# Altium project Quadcopter_Main_PCB.PrjPcb
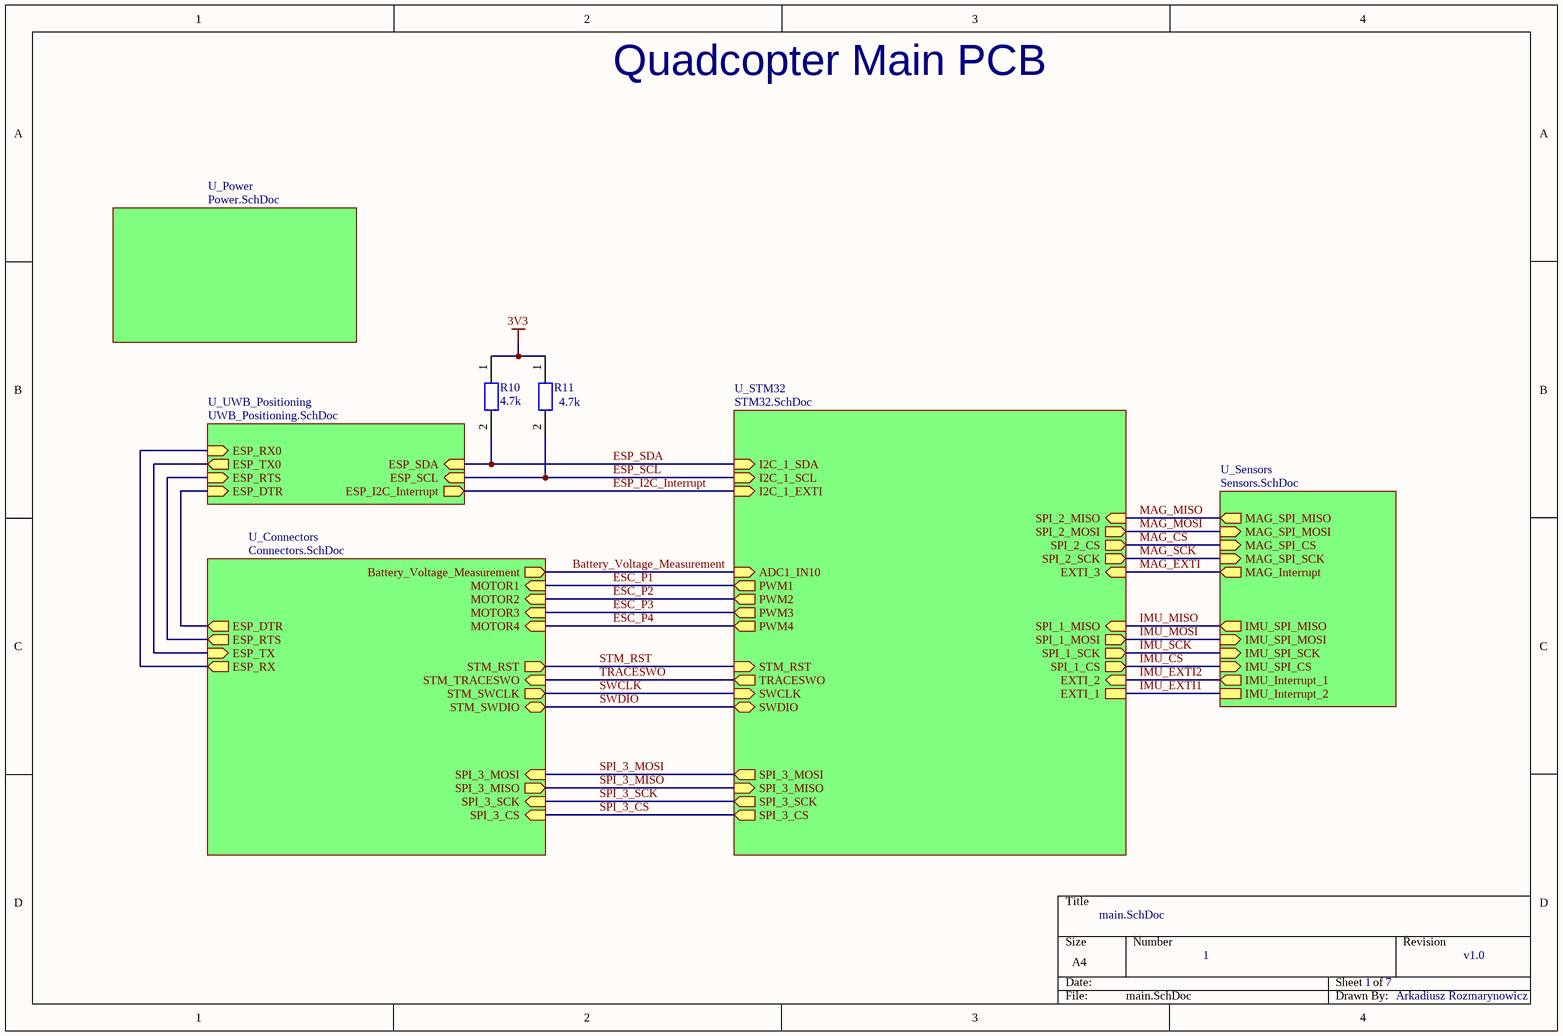
[diagram p0: main.SchDoc]
Author_Name: Arkadiusz Rozmarynowicz; Project_Revision: v1.0
7 sheets, 101 parts. Net scope: hierarchical (ports join the sheet entries above them; power ports are global).
Board file: Quadcopter_Main_PCB.PcbDoc
Sheets:
  main.SchDoc
    U_Power = Power.SchDoc
    U_Connectors = Connectors.SchDoc
    U_UWB_Positioning = UWB_Positioning.SchDoc
    U_Sensors = Sensors.SchDoc
    U_STM32 = STM32.SchDoc
      U_Interface_STM32 = Interface_STM32.SchDoc

## Sheet main.SchDoc
size A4; Author: Arkadiusz Rozmarynowicz; DrawnBy: Arkadiusz Rozmarynowicz; DocumentNumber: 1; SheetNumber: 1; SheetTotal: 7

### Parts
R10  4.7k  [Res_0603_Medium_Density]
R11  4.7k  [Res_0603_Medium_Density]

### Sub-sheets
U_Connectors = Connectors.SchDoc: ESP_RTS (out), ESP_DTR (out), ESP_RX (out), STM_SWCLK (out), STM_RST (out), ESP_TX (in), STM_SWDIO (bidir), MOTOR1 (in), MOTOR2 (in), MOTOR3 (in), MOTOR4 (in), STM_TRACESWO (in), Battery_Voltage_Measurement (out), SPI_3_CS (in), SPI_3_SCK (in), SPI_3_MISO (out), SPI_3_MOSI (in)
U_Power = Power.SchDoc: no entries
U_Sensors = Sensors.SchDoc: MAG_SPI_MISO (out), MAG_SPI_MOSI (in), MAG_SPI_CS (in), MAG_SPI_SCK (in), MAG_Interrupt (out), IMU_SPI_MISO (out), IMU_SPI_MOSI (in), IMU_SPI_SCK (in), IMU_SPI_CS (in), IMU_Interrupt_1 (out), IMU_Interrupt_2
U_STM32 = STM32.SchDoc: SPI_1_CS (out), SPI_1_SCK (out), SPI_1_MISO (in), SPI_1_MOSI (out), PWM1 (out), PWM2 (out), PWM3 (out), PWM4 (out), SWDIO (bidir), SWCLK (in), SPI_3_CS (out), SPI_2_MISO (in), SPI_2_MOSI (out), SPI_3_SCK (out), SPI_3_MISO (in), SPI_3_MOSI (out), SPI_2_CS (out), SPI_2_SCK (out), TRACESWO (out), ADC1_IN10 (in), EXTI_2 (in), EXTI_3 (in), I2C_1_SCL (in), I2C_1_SDA (in), STM_RST (in), EXTI_1, I2C_1_EXTI (in)
U_UWB_Positioning = UWB_Positioning.SchDoc: ESP_DTR (in), ESP_RX0 (in), ESP_TX0 (out), ESP_RTS (in), ESP_I2C_Interrupt (out), ESP_SDA (in), ESP_SCL (in)

### Nets
3V3: R10.1 R11.1
Battery_Voltage_Measurement: sheet U_Connectors/Battery_Voltage_Measurement, sheet U_STM32/ADC1_IN10
ESC_P1: sheet U_Connectors/MOTOR1, sheet U_STM32/PWM1
ESC_P2: sheet U_Connectors/MOTOR2, sheet U_STM32/PWM2
ESC_P3: sheet U_Connectors/MOTOR3, sheet U_STM32/PWM3
ESC_P4: sheet U_Connectors/MOTOR4, sheet U_STM32/PWM4
ESP_DTR: sheet U_Connectors/ESP_DTR, sheet U_UWB_Positioning/ESP_DTR
ESP_I2C_Interrupt: sheet U_UWB_Positioning/ESP_I2C_Interrupt, sheet U_STM32/I2C_1_EXTI
ESP_RTS: sheet U_Connectors/ESP_RTS, sheet U_UWB_Positioning/ESP_RTS
ESP_RXD0: sheet U_Connectors/ESP_RX, sheet U_UWB_Positioning/ESP_RX0
ESP_SCL: R11.2 ; sheet U_UWB_Positioning/ESP_SCL, sheet U_STM32/I2C_1_SCL
ESP_SDA: R10.2 ; sheet U_UWB_Positioning/ESP_SDA, sheet U_STM32/I2C_1_SDA
ESP_TXD0: sheet U_Connectors/ESP_TX, sheet U_UWB_Positioning/ESP_TX0
IMU_CS: sheet U_Sensors/IMU_SPI_CS, sheet U_STM32/SPI_1_CS
IMU_EXTI1: sheet U_Sensors/IMU_Interrupt_2, sheet U_STM32/EXTI_1
IMU_EXTI2: sheet U_Sensors/IMU_Interrupt_1, sheet U_STM32/EXTI_2
IMU_MISO: sheet U_Sensors/IMU_SPI_MISO, sheet U_STM32/SPI_1_MISO
IMU_MOSI: sheet U_Sensors/IMU_SPI_MOSI, sheet U_STM32/SPI_1_MOSI
IMU_SCK: sheet U_Sensors/IMU_SPI_SCK, sheet U_STM32/SPI_1_SCK
MAG_CS: sheet U_Sensors/MAG_SPI_CS, sheet U_STM32/SPI_2_CS
MAG_EXTI: sheet U_Sensors/MAG_Interrupt, sheet U_STM32/EXTI_3
MAG_MISO: sheet U_Sensors/MAG_SPI_MISO, sheet U_STM32/SPI_2_MISO
MAG_MOSI: sheet U_Sensors/MAG_SPI_MOSI, sheet U_STM32/SPI_2_MOSI
MAG_SCK: sheet U_Sensors/MAG_SPI_SCK, sheet U_STM32/SPI_2_SCK
SPI_3_CS: sheet U_Connectors/SPI_3_CS, sheet U_STM32/SPI_3_CS
SPI_3_MISO: sheet U_Connectors/SPI_3_MISO, sheet U_STM32/SPI_3_MISO
SPI_3_MOSI: sheet U_Connectors/SPI_3_MOSI, sheet U_STM32/SPI_3_MOSI
SPI_3_SCK: sheet U_Connectors/SPI_3_SCK, sheet U_STM32/SPI_3_SCK
STM_RST: sheet U_Connectors/STM_RST, sheet U_STM32/STM_RST
SWCLK: sheet U_Connectors/STM_SWCLK, sheet U_STM32/SWCLK
SWDIO: sheet U_Connectors/STM_SWDIO, sheet U_STM32/SWDIO
TRACESWO: sheet U_Connectors/STM_TRACESWO, sheet U_STM32/TRACESWO

### Notes on the sheet
- Quadcopter Main PCB

### Library data of the parts
R10 R11 = Resistor_SMD: Part Number: AC0603JR-104K7L; Value: 4.7k; Manufacturer: *; Supplier: Mouser; Voltage: *; ComponentLink1Description: Online Store Link; ComponentLink1URL: *; Package: 0603

## Sheet Power.SchDoc
size A4; DocumentNumber: 2; SheetNumber: 2; SheetTotal: 7
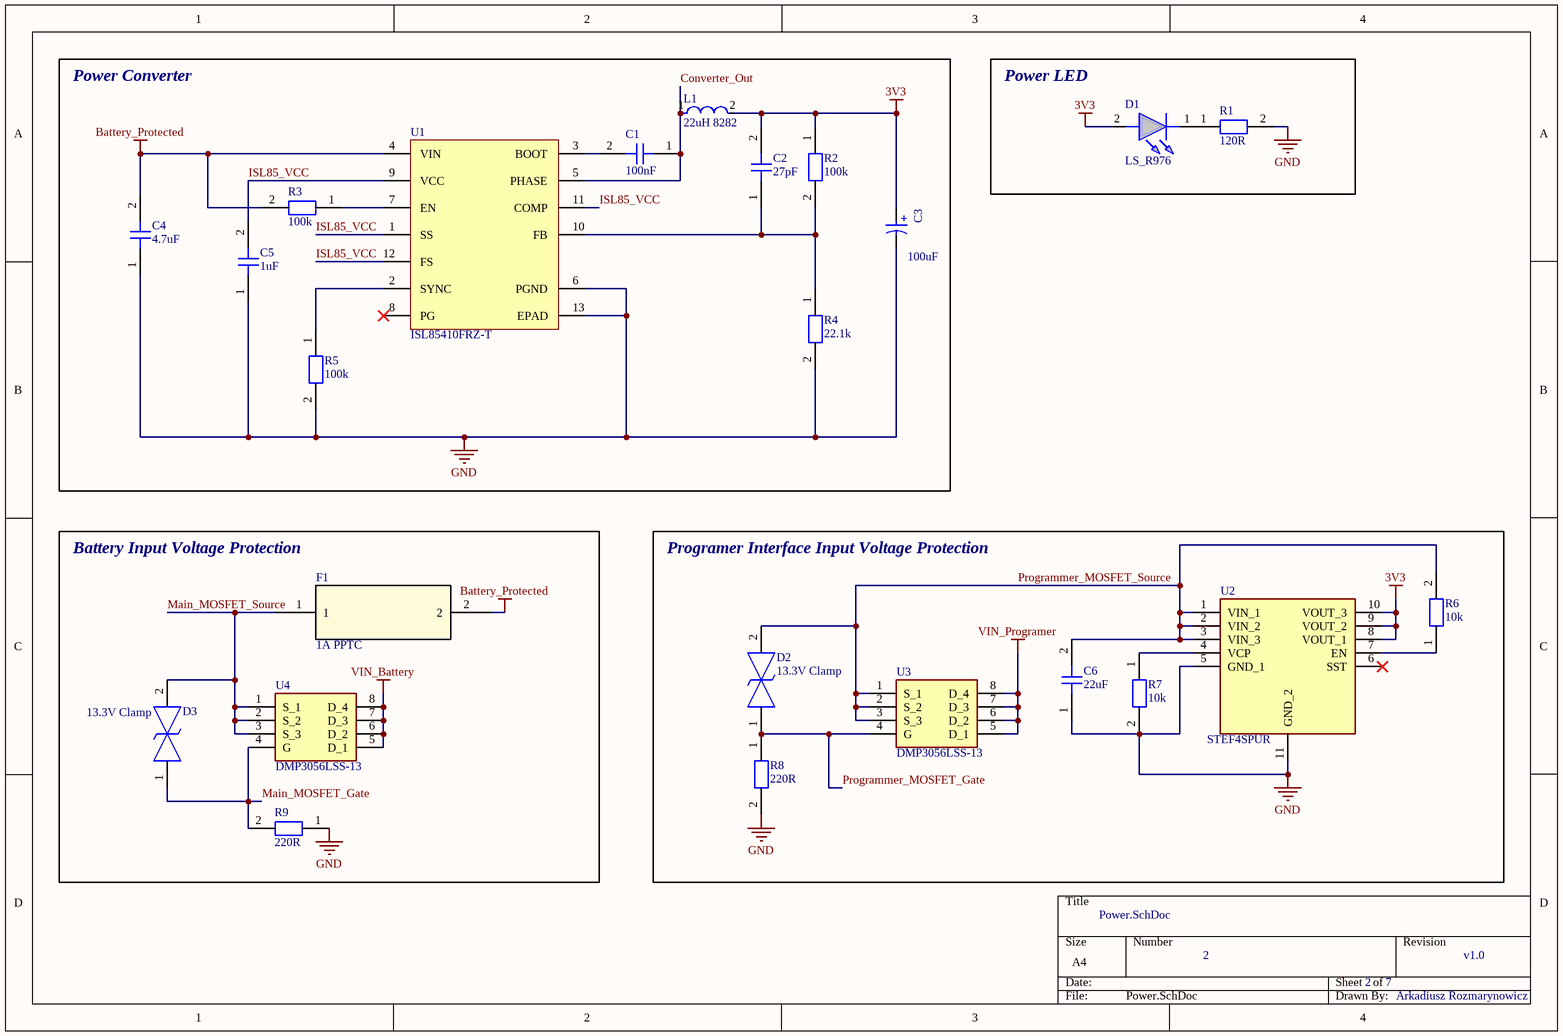
[diagram p1: Power.SchDoc]

### Parts
C1  100nF  [Cap_0603_Medium_Density]
C2  27pF  [Cap_0603_Medium_Density]
C3  100uF  [WCAP-ASLL_D6.3H5.5]
C4  4.7uF  [Cap_0603_Medium_Density]
C5  1uF  [Cap_0603_Medium_Density]
C6  22uF  [Cap_0603_Medium_Density]
D1  LS_R976  [LEDC2012X40N]
D2  13.3V Clamp  [DIONM5127X250N]
D3  13.3V Clamp  [DIONM5127X250N]
F1  1A PPTC  [CHIP_ 0603L_1P8X1_LTF]
L1  22uH 8282  [FP-IHLP-3232DZ-FP_2_413x5-MFG]
R1  120R  [Res_0603_Medium_Density]
R2  100k  [Res_0603_Medium_Density]
R3  100k  [Res_0603_Medium_Density]
R4  22.1k  [Res_0603_Medium_Density]
R5  100k  [Res_0603_Medium_Density]
R6  10k  [Res_0603_Medium_Density]
R7  10k  [Res_0603_Medium_Density]
R8  220R  [Res_0603_Medium_Density]
R9  220R  [Res_0603_Medium_Density]
U1  ISL85410FRZ-T  [L12_4x3_MFG]
U2  STEF4SPUR  [SON50P300X300X80-11N-D]
U3  DMP3056LSS-13  [SOIC127P600X170-8N]
U4  DMP3056LSS-13  [SOIC127P600X170-8N]

### Blocks framed on the sheet
Power Converter: C1-C5 L1 R2-R5 U1
Power LED: D1 R1
Battery Input Voltage Protection: D3 F1 R9 U4
Programer Interface Input Voltage Protection: C6 D2 R6-R8 U2 U3

### Nets
3V3: C2.2 C3.1(P) D1.2(A) L1.2 R2.1 U2.8(VOUT_1) U2.9(VOUT_2) U2.10(VOUT_3)
Battery_Protected: C4.2 F1.2 R3.2 U1.4(VIN)
GND: C3.2(N) C4.1 C5.1 C6.1 R1.2 R4.2 R5.2 R7.2 R8.2 R9.1 U1.6(PGND) U1.13(EPAD) U2.5(GND_1) U2.11(GND_2)
VIN_Battery: U4.5(D_1) U4.6(D_2) U4.7(D_3) U4.8(D_4)
VIN_Programer: U3.5(D_1) U3.6(D_2) U3.7(D_3) U3.8(D_4)
Converter_Out: C1.1 L1.1 U1.5(PHASE)
ISL85_VCC: C5.2 U1.1(SS) U1.9(VCC) U1.11(COMP) U1.12(FS)
Main_MOSFET_Gate: D3.1 R9.2 U4.4(G)
Main_MOSFET_Source: D3.2 F1.1 U4.1(S_1) U4.2(S_2) U4.3(S_3)
Programmer_MOSFET_Gate: D2.1 R8.1 U3.4(G)
Programmer_MOSFET_Source: C6.2 D2.2 R6.2 U2.1(VIN_1) U2.2(VIN_2) U2.3(VIN_3) U3.1(S_1) U3.2(S_2) U3.3(S_3)
NetC1_2: C1.2 U1.3(BOOT)
NetC2_1: C2.1 R2.2 R4.1 U1.10(FB)
NetD1_1: D1.1(K) R1.1
NetR3_1: R3.1 U1.7(EN)
NetR5_1: R5.1 U1.2(SYNC)
NetR6_1: R6.1 U2.7(EN)
NetR7_1: R7.1 U2.4(VCP)

Not connected (* = marked no-connect by the designer): U1 8(PG)*; U2 6(SST)*

### Notes on the sheet
- (in symbol CMP-03913-53914511-3) +

### Library data of the parts
C1 = Capacitor_MLLC: Part Number: CC0603KRX7R8BB104; Supplier: Mouser; ComponentLink1Description: Online Store Link; ComponentLink1URL: *; Manufacturer: *; Value: 100nF; Voltage: *; Package: 0603
C2 = Capacitor_MLLC: Part Number: CC0603JRNP09BN270; Supplier: Mouser; ComponentLink1Description: Online Store Link; ComponentLink1URL: *; Manufacturer: *; Value: 27pF; Voltage: *; Package: 0603
C3 = CMP-03913-53914511-3: WCAP-ASLL Aluminum Electrolytic Capacitors; Part Number: 865060343005; Life (Hours): 2000hours; Voltage Rating (DC): 16V; Ripple Current (AC): 255mA; Impedance: 440mΩ; ESR (Equivalent Series Resistance): 393.664mΩ; Insulation Resistance: 1MΩ; Leakage Current: 16µA; Capacitance: 100µF; Voltage Rating: 16V; Min Operating Temperature: -55°C; Ripple Current: 255mA; REACH SVHC: Unknown; Case/Package: Radial; Diameter: 6.3mm; Max Operating Temperature: 105°C; Packaging: Cut Tape; Length: 5.5mm; Height: 5.5mm; Supplier: Mouser; Value: 100uF
C4 = Capacitor_MLLC: Part Number: 06035U4R7JAT2A; Supplier: Mouser; ComponentLink1Description: Online Store Link; ComponentLink1URL: *; Manufacturer: *; Value: 4.7uF; Voltage: *; Package: 0603
C5 = Capacitor_MLLC: Part Number: CC0603KRX5R6BB105; Supplier: Mouser; ComponentLink1Description: Online Store Link; ComponentLink1URL: *; Manufacturer: *; Value: 1uF; Voltage: *; Package: 0603
C6 = Capacitor_MLLC: Part Number: CC0603MRX6S4BB226; Supplier: Mouser; ComponentLink1Description: Online Store Link; ComponentLink1URL: *; Manufacturer: *; Value: 22uF; Voltage: *; Package: 0603
D1 = LS_R976: Red 0805 CHIPLED LS R976N-R102 Osram Opto LS R976, CHIPLED 0805 Series Red LED, 633 nm, 2012 (0805), Rectangle Lens SMD Package; Manufacturer_Name: ams OSRAM; Manufacturer_Part_Number: LS R976; Geometry.Height: 0.4mm; Mouser Part Number: 720-LSR976D5178; Mouser Price/Stock: https://www.mouser.co.uk/ProductDetail/OSRAM-Opto-Semiconductors/LS-R976?qs=OIr7YF%252B2cWVTfzKl425Fkw%3D%3D; Datasheet Link: http://uk.rs-online.com/web/p/products/4974804; Part Number: LS R976; Supplier: Mouser
D2 D3 = SMAJ12CA-HP6AT_13: 19.9V Clamp 30.2A Ipp Tvs Diode Surface Mount DO-214AC (SMA); Manufacturer_Name: YAGEO; Manufacturer_Part_Number: SMAJ12CA-HP6AT/13; Geometry.Height: 2.5mm; Mouser Part Number: *; Mouser Price/Stock: *; Datasheet Link: https://www.yageo.com/upload/media/product/productsearch/datasheet/cpc/tvs/SMAJ-HP6AT_1.pdf; Part Number: SMAJ12CA-HP6AT/13; Supplier: Mouser
F1 = 0603L100SLYR: Description; Manufacturer_Name: Littelfuse Inc; Copyright: Copyright (C) 2025 Ultra Librarian. All rights reserved.; Manufacturer_Part_Number: 0603L100SLYR; RefDes: RefDes; Type: Type; Part Number: 0603L100SLYR; Supplier: Mouser
L1 = CMP-02424-000385-1: Commercial Inductors, High Temperature (155 °C) Series 22uH 3.7A 110.21mΩ 20%; Part Number: IHLP3232DZER220M51; Max DC Current: 3.8A; Self Resonant Frequency: 9MHz; Test Frequency: 100kHz; Shielding: Shielded; Length: 0.322inch; Inductance: 22uH; Package Quantity: 500; Military Standard: Not; Min Operating Temperature: -55°C; Lead Free: Lead Free; Packaging: Tape and Reel; Current Rating: 3.7A; Height: 4mm; Max Operating Temperature: 155°C; Width: 0.322inch; Tolerance: 20%; Case/Package: 3232; Saturation Current: 3.8A; Height - Seated (Max): 0.158inch; Mount: Surface Mount; Termination: SMD/SMT; Supplier: Mouser
R1 = Resistor_SMD: Part Number: CR0603-JW-121ELF; Value: 120R; Manufacturer: *; Supplier: Mouser; Voltage: *; ComponentLink1Description: Online Store Link; ComponentLink1URL: *; Package: 0603
R2 R3 R5 = Resistor_SMD: Part Number: AF0603FR-13100KL; Value: 100k; Manufacturer: *; Supplier: Mouser; Voltage: *; ComponentLink1Description: Online Store Link; ComponentLink1URL: *; Package: 0603
R4 = Resistor_SMD: Part Number: CRCW060322K1FKEBC; Value: 22.1k; Manufacturer: *; Supplier: Mouser; Voltage: *; ComponentLink1Description: Online Store Link; ComponentLink1URL: *; Package: 0603
R6 R7 = Resistor_SMD: Part Number: CR0603AFX-1002EAS; Value: 10k; Manufacturer: *; Supplier: Mouser; Voltage: *; ComponentLink1Description: Online Store Link; ComponentLink1URL: *; Package: 0603
R8 R9 = Resistor_SMD: Part Number: CR0603-JW-221ELF; Value: 220R; Manufacturer: *; Supplier: Mouser; Voltage: *; ComponentLink1Description: Online Store Link; ComponentLink1URL: *; Package: 0603
U1 = CMP-00572-88255842-3: Inverter RoHS Compliant Adjustable Positive Switching Regulator IC 125C 2MHz 1A 82.298666mg; Manufacturer Lifecycle Status: ACTIVE; Efficiency: 94%; RAM Size: 12kB; Max Supply Voltage: 40V; Topology: Buck; Min Output Voltage: 600mV; Max Junction Temperature (Tj): 125°C; Min Supply Voltage: 3V; Pitch: 500µm; Operating Supply Current: 4µA; Sync/Async: Synchronous; Max Output Voltage: 34V; Number of Outputs: 1; Synchronous Rectifier: Yes; Operating Supply Voltage: 36V; Quiescent Current: 80µA; HelpURL: https://octopart.com/cad-content/api/get-model-datasheet/15189/88255842; ComponentLink1URL: http://www.renesas.com; Switching Frequency: 2MHz; ComponentLink3URL: https://www.renesas.com/en/document/psc/l124x3-12-lead-dual-flat-no-lead-plastic-package?r=568491; Max Operating Temperature: 125°C; Export Control Classification Number (ECCN) Code: EAR99; Lead Free: Lead Free; ComponentLink2Description: Datasheet URL; Length: 4mm; Min Operating Temperature: -40°C; ComponentLink2URL: https://octopart.com/cad-content/api/get-model-datasheet/15189/88255842; ComponentLink1Description: Manufacturer's Website; Width: 3mm; Output Type: Adjustable; Max Output Current: 1A; Packaging: Tape & Reel; Case/Package: DFN; Mount: Surface Mount; Number of Pins: 12; Weight: 82.298666mg; Min Input Voltage: 3V; ComponentLink3Description: Manufacturer's Package Drawing; Max Input Voltage: 40V; Logic Function: Inverter; RoHS: Compliant; Output Current: 1A; Output Configuration: Positive; Lifecycle Status: Production; Height: 900µm; Output Voltage: 34V; Radiation Hardening: No; Part Number: ISL85410FRZ-T; Supplier: Mouser
U2 = STEF4SPUR: Hot Swap Voltage Controllers Electronic fuse 4V 3.6A 40mW 4.5V; Manufacturer_Name: STMicroelectronics; Geometry.Height: 0.8mm; Manufacturer_Part_Number: STEF4SPUR; Mouser Part Number: 511-STEF4SPUR; Mouser Price/Stock: https://www.mouser.co.uk/ProductDetail/STMicroelectronics/STEF4SPUR?qs=DqCdCwOw4%2F72PHOKVsUxjg%3D%3D; Datasheet Link: https://www.st.com/resource/en/datasheet/stef4s.pdf; Part Number: STEF4SPUR; Supplier: Mouser
U3 U4 = DMP3056LSS-13: MOSFET P Channel 30V 7.1A 2.1V @ 250uA 45m @ 6A,10V SOP-8_150mil RoHS; Manufacturer_Name: Diodes Incorporated; Geometry.Height: 1.7mm; Manufacturer_Part_Number: DMP3056LSS-13; Mouser Part Number: 621-DMP3056LSS-13; Mouser Price/Stock: https://www.mouser.co.uk/ProductDetail/Diodes-Incorporated/DMP3056LSS-13?qs=oUsD4qhOtFyEnPLZKitYRA%3D%3D; Datasheet Link: https://www.diodes.com//assets/Datasheets/ds31421.pdf; Part Number: DMP3056LSS-13; Supplier: Mouser

## Sheet Connectors.SchDoc
size A4; DocumentNumber: 3; SheetNumber: 3; SheetTotal: 7
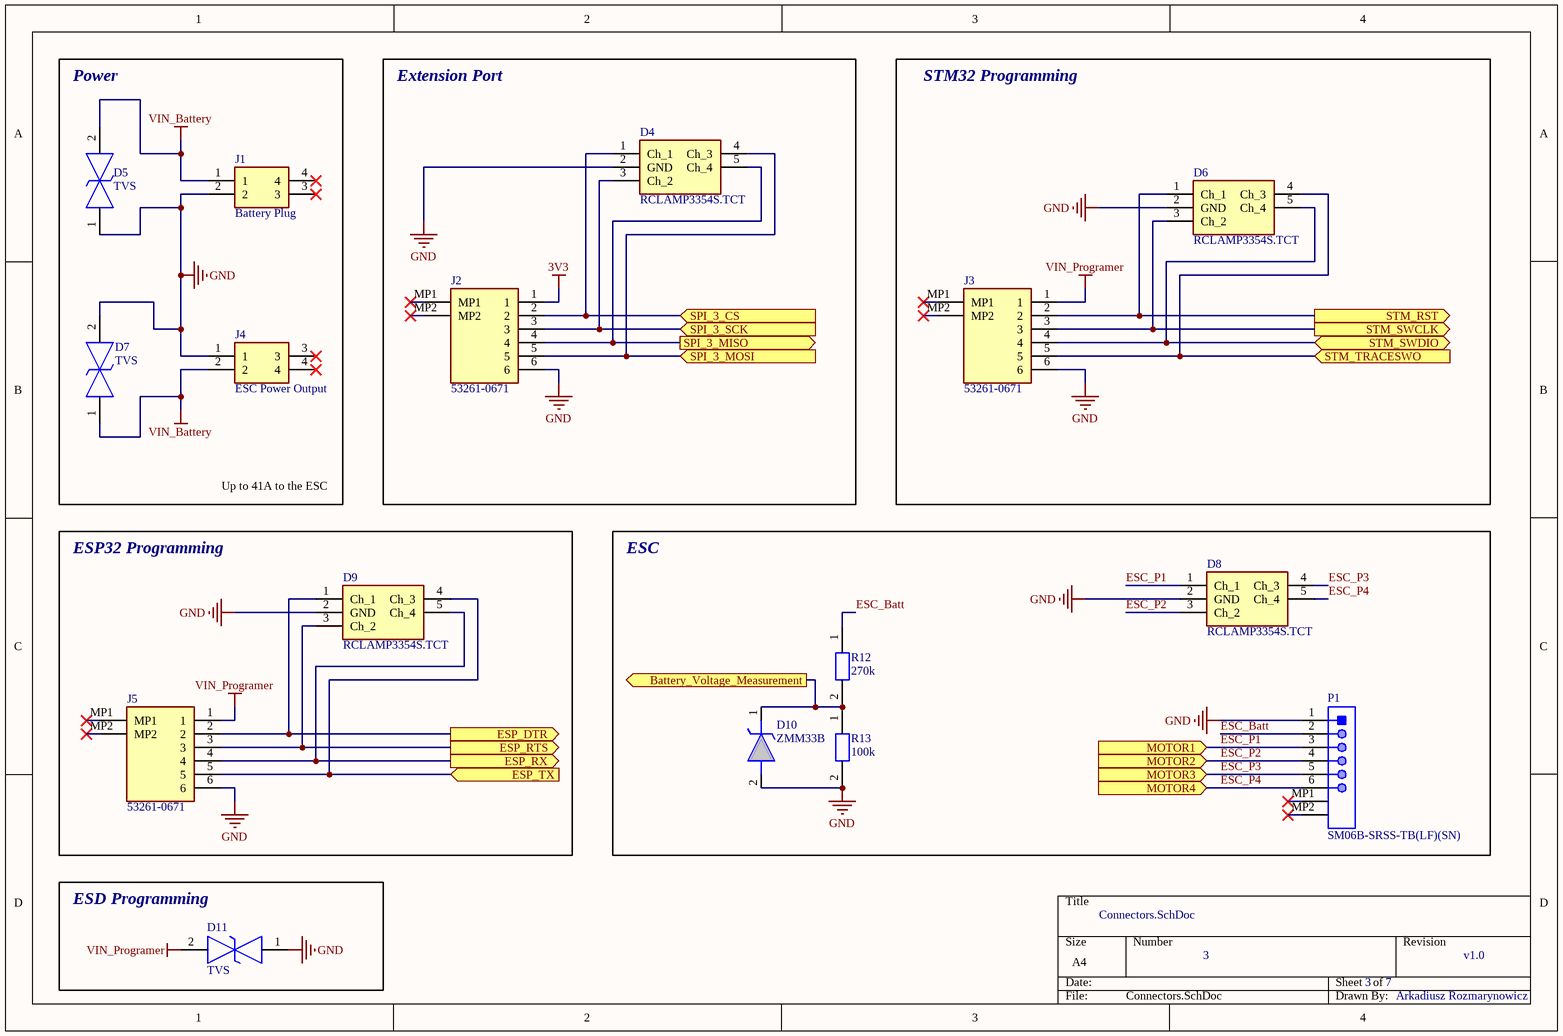
[diagram p2: Connectors.SchDoc]

### Parts
D4  RCLAMP3354S.TCT  [SOT95P280X145-5N]
D5  TVS  [DIONM5127X250N]
D6  RCLAMP3354S.TCT  [SOT95P280X145-5N]
D7  TVS  [DIONM5127X250N]
D8  RCLAMP3354S.TCT  [SOT95P280X145-5N]
D9  RCLAMP3354S.TCT  [SOT95P280X145-5N]
D10  ZMM33B  [ZMM33B]
D11  TVS  [AQ120501LTG]
J1  Battery Plug  [XT30PWM]
J2  53261-0671  [532610671]
J3  53261-0671  [532610671]
J4  ESC Power Output  [XT30PWF]
J5  53261-0671  [532610671]
P1  SM06B-SRSS-TB(LF)(SN)  [JST-SM06B-SRSS-TB_V]
R12  270k  [Res_0603_Medium_Density]
R13  100k  [Res_0603_Medium_Density]

### Blocks framed on the sheet
Power: D5 D7 J1 J4
Extension Port: D4 J2
STM32 Programming: D6 J3
ESP32 Programming: D9 J5
ESC: D8 D10 P1 R12 R13
ESD Programming: D11

### Ports
Battery_Voltage_Measurement (out), ESP_DTR (out), ESP_RTS (out), ESP_RX (out), ESP_TX (in), MOTOR1 (in), MOTOR2 (in), MOTOR3 (in), MOTOR4 (in), SPI_3_CS (in), SPI_3_MISO (out), SPI_3_MOSI (in), SPI_3_SCK (in), STM_RST (out), STM_SWCLK (out), STM_SWDIO (bidir), STM_TRACESWO (in)

### Nets
3V3: J2.1
GND: D4.2(GND) D5.1 D6.2(GND) D7.2 D8.2(GND) D9.2(GND) D10.2(A) D11.1 J1.2 J2.6 J3.6 J4.1 J5.6 P1.1 R13.2
VIN_Battery: D5.2 D7.1 J1.1 J4.2
VIN_Programer: D11.2 J3.1 J5.1
Battery_Voltage_Measurement: D10.1(K) R12.2 R13.1 ; port Battery_Voltage_Measurement
ESC_Batt: P1.2 R12.1
ESC_P1: D8.1(Ch_1) P1.3 ; port MOTOR1
ESC_P2: D8.3(Ch_2) P1.4 ; port MOTOR2
ESC_P3: D8.4(Ch_3) P1.5 ; port MOTOR3
ESC_P4: D8.5(Ch_4) P1.6 ; port MOTOR4
ESP_DTR: D9.1(Ch_1) J5.2 ; port ESP_DTR
ESP_RTS: D9.3(Ch_2) J5.3 ; port ESP_RTS
ESP_RXD0: D9.5(Ch_4) J5.4 ; port ESP_RX
ESP_TXD0: D9.4(Ch_3) J5.5 ; port ESP_TX
SPI_3_CS: D4.1(Ch_1) J2.2 ; port SPI_3_CS
SPI_3_MISO: D4.5(Ch_4) J2.4 ; port SPI_3_MISO
SPI_3_MOSI: D4.4(Ch_3) J2.5 ; port SPI_3_MOSI
SPI_3_SCK: D4.3(Ch_2) J2.3 ; port SPI_3_SCK
STM_RST: D6.1(Ch_1) J3.2 ; port STM_RST
SWCLK: D6.3(Ch_2) J3.3 ; port STM_SWCLK
SWDIO: D6.5(Ch_4) J3.4 ; port STM_SWDIO
TRACESWO: D6.4(Ch_3) J3.5 ; port STM_TRACESWO

Not connected (* = marked no-connect by the designer): J1 3* 4*; J2 MP1* MP2*; J3 MP1* MP2*; J4 3* 4*; J5 MP1* MP2*; P1 MP1* MP2*

### Notes on the sheet
- Up to 41A to the ESC

### Library data of the parts
D4 D6 D8 D9 = RCLAMP3354S.TCT: ESD Suppressors / TVS Diodes 3.3V 4 LINE LOW CAP; Manufacturer_Name: SEMTECH; Geometry.Height: 1.45mm; Manufacturer_Part_Number: RCLAMP3354S.TCT; Mouser Part Number: 947-RCLAMP3354S.TCT; Mouser Price/Stock: https://www.mouser.co.uk/ProductDetail/Semtech/RCLAMP3354S.TCT?qs=rBWM4%252BvDhIcjyMg1J9MbMw%3D%3D; Datasheet Link: https://semtech.my.salesforce.com/sfc/p/#E0000000JelG/a/44000000MCrm/q3IJaquvh9BkANCL4E8HYT8vxS.k3jwPHRhsWr6XNsI; Part Number: RCLAMP3354S.TCT; Supplier: Mouser
D5 D7 = SMAJ12CA-HP6AT_13: as D2 on sheet Power; Mouser Part Number: *; Mouser Price/Stock: *; Datasheet Link: https://www.yageo.com/upload/media/product/productsearch/datasheet/cpc/tvs/SMAJ-HP6AT_1.pdf; Part Number: SMAJ12CA-HP6AT/13; Supplier: Mouser
D10 = ZMM33B: SMD Planra Zener Diode; Manufacturer_Name: Diotec; Geometry.Height: 1.45mm; Manufacturer_Part_Number: ZMM33B; Mouser Part Number: 637-ZMM33B; Mouser Price/Stock: https://www.mouser.co.uk/ProductDetail/Diotec-Semiconductor/ZMM33B?qs=OlC7AqGiEDlS5hTI7j6ASg%3D%3D; Datasheet Link: *; Part Number: ZMM33B; Supplier: Mouser
D11 = AQ1205-01LTG: 7pF, 7A, SOD523, Bidirectional Discrete TVS Diode, General Purpose ESD Protection; Manufacturer_Name: LITTELFUSE; Geometry.Height: 0.77mm; Manufacturer_Part_Number: AQ1205-01LTG; Mouser Part Number: *; Mouser Price/Stock: *; Datasheet Link: https://www.littelfuse.com/assetdocs/littelfuse-tvs-diode-array-aq1205-01ltg-datashee?assetguid=bd1b547a-f82e-4cfc-8f41-242773d1850e; Part Number: AQ1205-01LTG; Supplier: Mouser
J1 = XT30PW-M: 30A Low Temperature Rise Fire Retardant Plug; Manufacturer_Name: Amass; Geometry.Height: 5mm; Manufacturer_Part_Number: XT30PW-M; Mouser Part Number: *; Mouser Price/Stock: *; Datasheet Link: https://www.tme.eu/sl/Document/ce4077e36b79046da520ca73227e15de/XT30PW%20SPEC.pdf; Part Number: XT30PW-M
J2 J3 J5 = 53261-0671: 1.25mm Pitch, PicoBlade PCB Header, Single Row, Right-Angle, Surface Mount, Tin (Sn) Plating, Friction Lock,  Circuits, Tape and Reel; Manufacturer_Name: Molex; Geometry.Height: 3.6mm; Manufacturer_Part_Number: 53261-0671; Mouser Part Number: 538-53261-0671; Mouser Price/Stock: https://www.mouser.co.uk/ProductDetail/Molex/53261-0671?qs=%252B72YyncTwW9Wyr77z4J2cA%3D%3D; Datasheet Link: https://www.molex.com/pdm_docs/sd/532610671_sd.pdf; Part Number: 53261-0671; Supplier: Mouser
J4 = XT30PW-F: Socket; DC supply; XT30; female; PIN:2; on PCBs; THT; Colour: yellow; Manufacturer_Name: Amass; Geometry.Height: 5mm; Manufacturer_Part_Number: XT30PW-F; Mouser Part Number: *; Mouser Price/Stock: *; Datasheet Link: https://www.tme.eu/Document/ce4077e36b79046da520ca73227e15de/XT30PW%20SPEC.pdf; Part Number: XT30PW-F
P1 = CMP-2000-07080-1: Male Header, Pitch 1 mm, 1 x 6 Position, Height 2.95 mm, -25 to 85 degC, RoHS, Tape and Reel; Manufacturer: JST; No of Positions: 6; Pitch: 1mm; Style/Orientation: RightAngleHeader/Plug; Datasheet URL: https://datasheet.ciiva.com/26894/getdatasheetpartid-708885-26894671.pdf; Package Description: Male Header, Pitch 1 mm, 1 X 6 Position, Height 2.9 mm; Termination: Solder; Manufacturer URL: http://www.jst.com/home2.html; Type: ShroudedHeader; Package Reference: SM06B-SRSS-TB; Datasheet Version: 11/2010; Mounting Technology: SurfaceMount; Manufacturer_Name: JST; Part Number: SM06B-SRSS-TB(LF)(SN); Supplier: Mouser
R12 = Resistor_SMD: Part Number: CR0603-JW-274ELF; Value: 270k; Manufacturer: *; Supplier: Mouser; Voltage: *; ComponentLink1Description: Online Store Link; ComponentLink1URL: *; Package: 0603
R13 = Resistor_SMD: Part Number: AF0603FR-13100KL; Value: 100k; Manufacturer: *; Supplier: Mouser; Voltage: *; ComponentLink1Description: Online Store Link; ComponentLink1URL: *; Package: 0603

## Sheet UWB_Positioning.SchDoc
size A4; DocumentNumber: 4; SheetNumber: 4; SheetTotal: 7
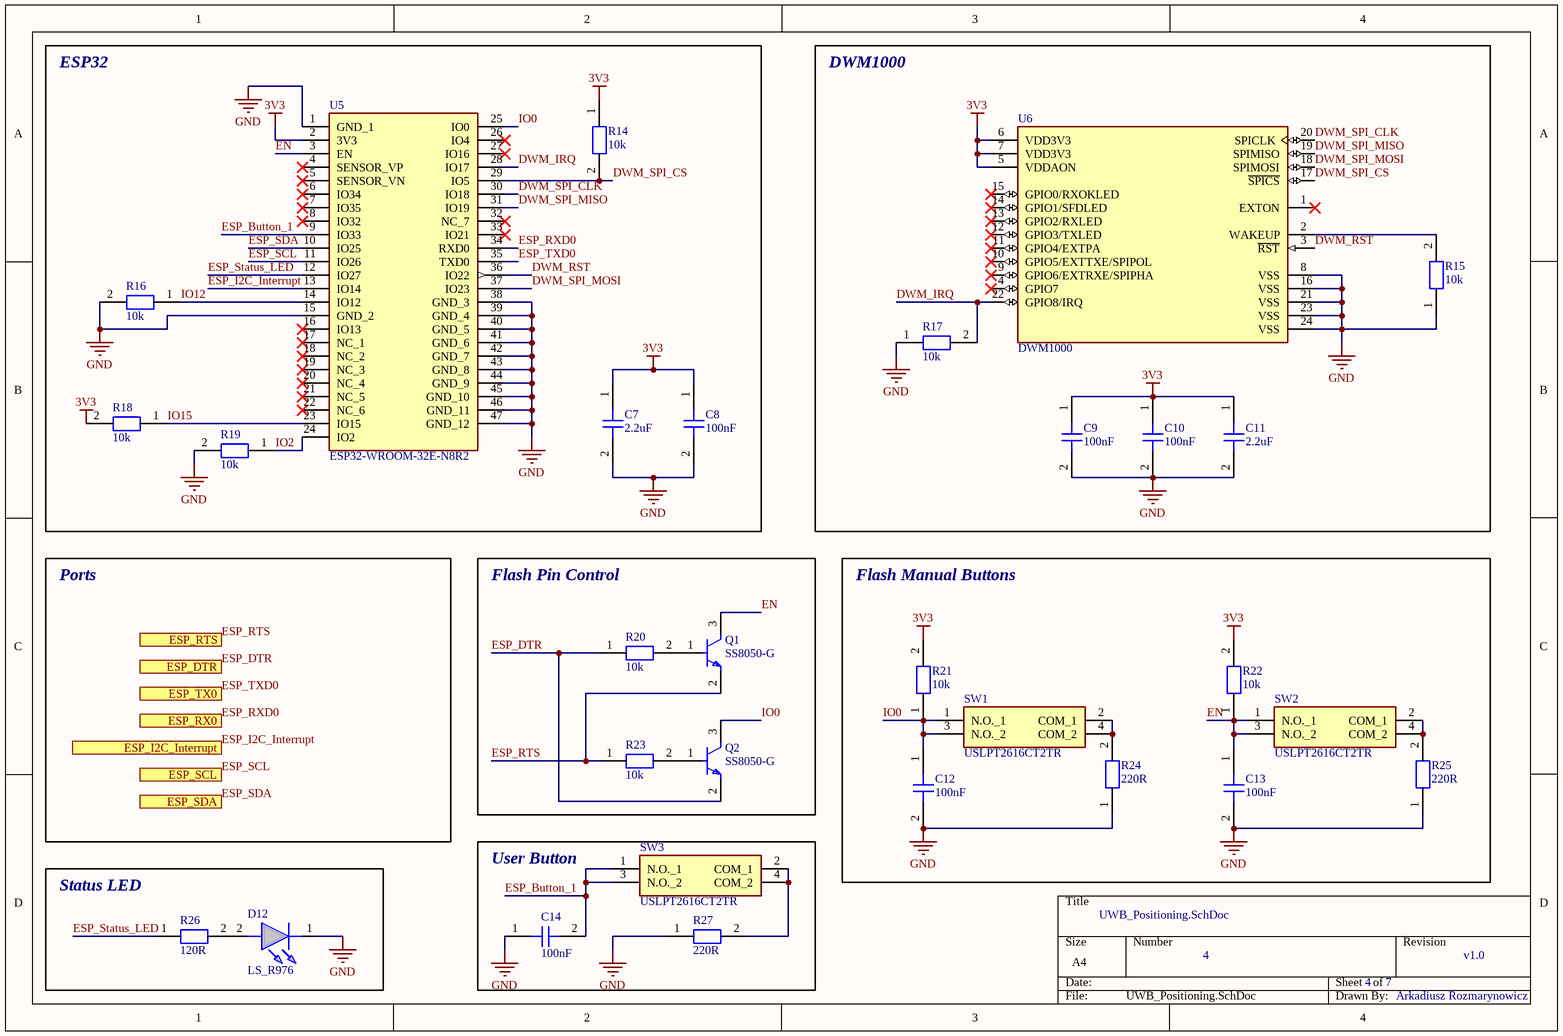
[diagram p3: UWB_Positioning.SchDoc]

### Parts
C7  2.2uF  [Cap_0603_Medium_Density]
C8  100nF  [Cap_0603_Medium_Density]
C9  100nF  [Cap_0603_Medium_Density]
C10  100nF  [Cap_0603_Medium_Density]
C11  2.2uF  [Cap_0603_Medium_Density]
C12  100nF  [Cap_0603_Medium_Density]
C13  100nF  [Cap_0603_Medium_Density]
C14  100nF  [Cap_0603_Medium_Density]
D12  LS_R976  [LEDC2012X40N]
Q1  SS8050-G  [FP-SS8050-G-MFG]
Q2  SS8050-G  [FP-SS8050-G-MFG]
R14  10k  [Res_0603_Medium_Density]
R15  10k  [Res_0603_Medium_Density]
R16  10k  [Res_0603_Medium_Density]
R17  10k  [Res_0603_Medium_Density]
R18  10k  [Res_0603_Medium_Density]
R19  10k  [Res_0603_Medium_Density]
R20  10k  [Res_0603_Medium_Density]
R21  10k  [Res_0603_Medium_Density]
R22  10k  [Res_0603_Medium_Density]
R23  10k  [Res_0603_Medium_Density]
R24  220R  [Res_0603_Medium_Density]
R25  220R  [Res_0603_Medium_Density]
R26  120R  [Res_0603_Medium_Density]
R27  220R  [Res_0603_Medium_Density]
SW1  USLPT2616CT2TR  [USLPT2616CT2TR]
SW2  USLPT2616CT2TR  [USLPT2616CT2TR]
SW3  USLPT2616CT2TR  [USLPT2616CT2TR]
U5  ESP32-WROOM-32E-N8R2  [ESP32WROOM32EN8R2]
U6  DWM1000  [FP-DWM1000-MFG]

### Blocks framed on the sheet
ESP32: C7 C8 R14 R16 R18 R19 U5
DWM1000: C9-C11 R15 R17 U6
Flash Pin Control: Q1 Q2 R20 R23
Flash Manual Buttons: C12 C13 R21 R22 R24 R25 SW1 SW2
User Button: C14 R27 SW3
Status LED: D12 R26

### Ports
ESP_DTR (in), ESP_I2C_Interrupt (out), ESP_RTS (in), ESP_RX0 (in), ESP_SCL (in), ESP_SDA (in), ESP_TX0 (out)

### Nets
3V3: C7.1 C8.1 C9.1 C10.1 C11.1 R14.1 R18.2 R21.2 R22.2 U5.2(3V3) U6.5(VDDAON) U6.6(VDD3V3) U6.7(VDD3V3)
GND: C7.2 C8.2 C9.2 C10.2 C11.2 C12.2 C13.2 C14.1 D12.1(K) R15.1 R16.2 R17.1 R19.2 R24.1 R25.1 R27.1 U5.1(GND_1) U5.15(GND_2) U5.38(GND_3) U5.39(GND_4) U5.40(GND_5) U5.41(GND_6) U5.42(GND_7) U5.43(GND_8) U5.44(GND_9) U5.45(GND_10) U5.46(GND_11) U5.47(GND_12) U6.8(VSS) U6.16(VSS) U6.21(VSS) U6.23(VSS) U6.24(VSS)
DWM_IRQ: R17.2 U5.28(IO17) U6.22(GPIO8/IRQ)
DWM_RST: U5.36(IO22) U6.3(~{RST})
DWM_SPI_CLK: U5.30(IO18) U6.20(SPICLK)
DWM_SPI_CS: R14.2 U5.29(IO5) U6.17(~{SPICS})
DWM_SPI_MISO: U5.31(IO19) U6.19(SPIMISO)
DWM_SPI_MOSI: U5.37(IO23) U6.18(SPIMOSI)
EN: C13.1 Q1.3(C) R22.1 SW2.1(N.O._1) SW2.3(N.O._2) U5.3(EN)
ESP_Button_1: C14.2 SW3.1(N.O._1) SW3.3(N.O._2) U5.9(IO33)
ESP_DTR: Q2.2(E) R20.1 ; port ESP_DTR
ESP_I2C_Interrupt: U5.13(IO14) ; port ESP_I2C_Interrupt
ESP_RTS: Q1.2(E) R23.1 ; port ESP_RTS
ESP_RXD0: U5.34(RXD0) ; port ESP_RX0
ESP_SCL: U5.11(IO26) ; port ESP_SCL
ESP_SDA: U5.10(IO25) ; port ESP_SDA
ESP_Status_LED: R26.1 U5.12(IO27)
ESP_TXD0: U5.35(TXD0) ; port ESP_TX0
IO0: C12.1 Q2.3(C) R21.1 SW1.1(N.O._1) SW1.3(N.O._2) U5.25(IO0)
IO2: R19.1 U5.24(IO2)
IO12: R16.1 U5.14(IO12)
IO15: R18.1 U5.23(IO15)
NetD12_2: D12.2(A) R26.2
NetQ1_1: Q1.1(B) R20.2
NetQ2_1: Q2.1(B) R23.2
NetR15_2: R15.2 U6.2(WAKEUP)
NetR24_2: R24.2 SW1.2(COM_1) SW1.4(COM_2)
NetR25_2: R25.2 SW2.2(COM_1) SW2.4(COM_2)
NetR27_2: R27.2 SW3.2(COM_1) SW3.4(COM_2)

Not connected (* = marked no-connect by the designer): U5 4(SENSOR_VP)* 5(SENSOR_VN)* 6(IO34)* 7(IO35)* 8(IO32)* 16(IO13)* 17(NC_1)* 18(NC_2)* 19(NC_3)* 20(NC_4)* 21(NC_5)* 22(NC_6)* 26(IO4)* 27(IO16)* 32(NC_7)* 33(IO21)*; U6 1(EXTON)* 4(GPIO7)* 9(GPIO6/EXTRXE/SPIPHA)* 10(GPIO5/EXTTXE/SPIPOL)* 11(GPIO4/EXTPA)* 12(GPIO3/TXLED)* 13(GPIO2/RXLED)* 14(GPIO1/SFDLED)* 15(GPIO0/RXOKLED)*

### Notes on the sheet
- Ports

### Library data of the parts
C7 C11 = Capacitor_MLLC: Part Number: 06036G225ZAT2A; Supplier: Mouser; ComponentLink1Description: Online Store Link; ComponentLink1URL: *; Manufacturer: *; Value: 2.2uF; Voltage: *; Package: 0603
C8-C10 C12-C14 = Capacitor_MLLC: Part Number: CC0603KRX7R8BB104; Supplier: Mouser; ComponentLink1Description: Online Store Link; ComponentLink1URL: *; Manufacturer: *; Value: 100nF; Voltage: *; Package: 0603
D12 = LS_R976: as D1 on sheet Power; Mouser Part Number: 720-LSR976D5178; Mouser Price/Stock: https://www.mouser.co.uk/ProductDetail/OSRAM-Opto-Semiconductors/LS-R976?qs=OIr7YF%252B2cWVTfzKl425Fkw%3D%3D; Datasheet Link: http://uk.rs-online.com/web/p/products/4974804; Part Number: LS R976; Supplier: Mouser
Q1 Q2 = CMP-20235-000001-1: NPN TRANSISTOR 1.5A 40V SOT-23 R; Transition Frequency: 100MHz; Max Breakdown Voltage: 25V; Collector Emitter Voltage (VCEO): 400mV; Max Power Dissipation: 300mW; Max Collector Current: 1.5A; Case/Package: TO-236-3; Packaging: Tape and Reel; RoHS Compliant: Yes; Mount: Surface Mount; Collector Emitter Breakdown Voltage: 25V; Part Number: SS8050-G; Supplier: Mouser
R14-R23 = Resistor_SMD: Part Number: CR0603AFX-1002EAS; Value: 10k; Manufacturer: *; Supplier: Mouser; Voltage: *; ComponentLink1Description: Online Store Link; ComponentLink1URL: *; Package: 0603
R24 R25 R27 = Resistor_SMD: Part Number: CR0603-JW-221ELF; Value: 220R; Manufacturer: *; Supplier: Mouser; Voltage: *; ComponentLink1Description: Online Store Link; ComponentLink1URL: *; Package: 0603
R26 = Resistor_SMD: Part Number: CR0603-JW-121ELF; Value: 120R; Manufacturer: *; Supplier: Mouser; Voltage: *; ComponentLink1Description: Online Store Link; ComponentLink1URL: *; Package: 0603
SW1-SW3 = USLPT2616CT2TR: Body Features: Actuator Profile Extended; Manufacturer_Name: TE Connectivity; Geometry.Height: 0.55mm; Manufacturer_Part_Number: USLPT2616CT2TR; Mouser Part Number: 506-USLPT2616CT2TR; Mouser Price/Stock: https://www.mouser.co.uk/ProductDetail/TE-Connectivity-Alcoswitch/USLPT2616CT2TR?qs=qSfuJ%252Bfl%2Fd725nA8XgU6qQ%3D%3D; Datasheet Link: https://www.te.com/commerce/DocumentDelivery/DDEController?Action=srchrtrv&DocNm=2337224-1&DocType=Data%20Sheet&DocLang=English&PartCntxt=2337224-1&DocFormat=pdf; Part Number: USLPT2616CT2TR; Supplier: Mouser
U5 = ESP32-WROOM-32E-N8R2: Multiprotocol Modules ESP32-WROOM-32E integrates ESP32-D0WD-V3, with higher stability and safety performance.; Manufacturer_Name: Espressif Systems; Geometry.Height: 3.25mm; Manufacturer_Part_Number: ESP32-WROOM-32E-N8R2; Mouser Part Number: 356-ESP32WRM32EN8R2; Mouser Price/Stock: https://www.mouser.co.uk/ProductDetail/Espressif-Systems/ESP32-WROOM-32E-N8R2?qs=By6Nw2ByBD0mvGJSS3Ohlw%3D%3D; Datasheet Link: https://www.espressif.com/sites/default/files/documentation/esp32-wroom-32e_esp32-wroom-32ue_datasheet_en.pdf; Part Number: ESP32-WROOM-32E-N8R2; Supplier: Mouser
U6 = CMP-231853-000001-1: RX TXRX MODULE 802.15.4 CHIP SMD; Part Number: DWM1000; Supplier: TME

## Sheet Sensors.SchDoc
size A4; DocumentNumber: 6; SheetNumber: 7; SheetTotal: 7
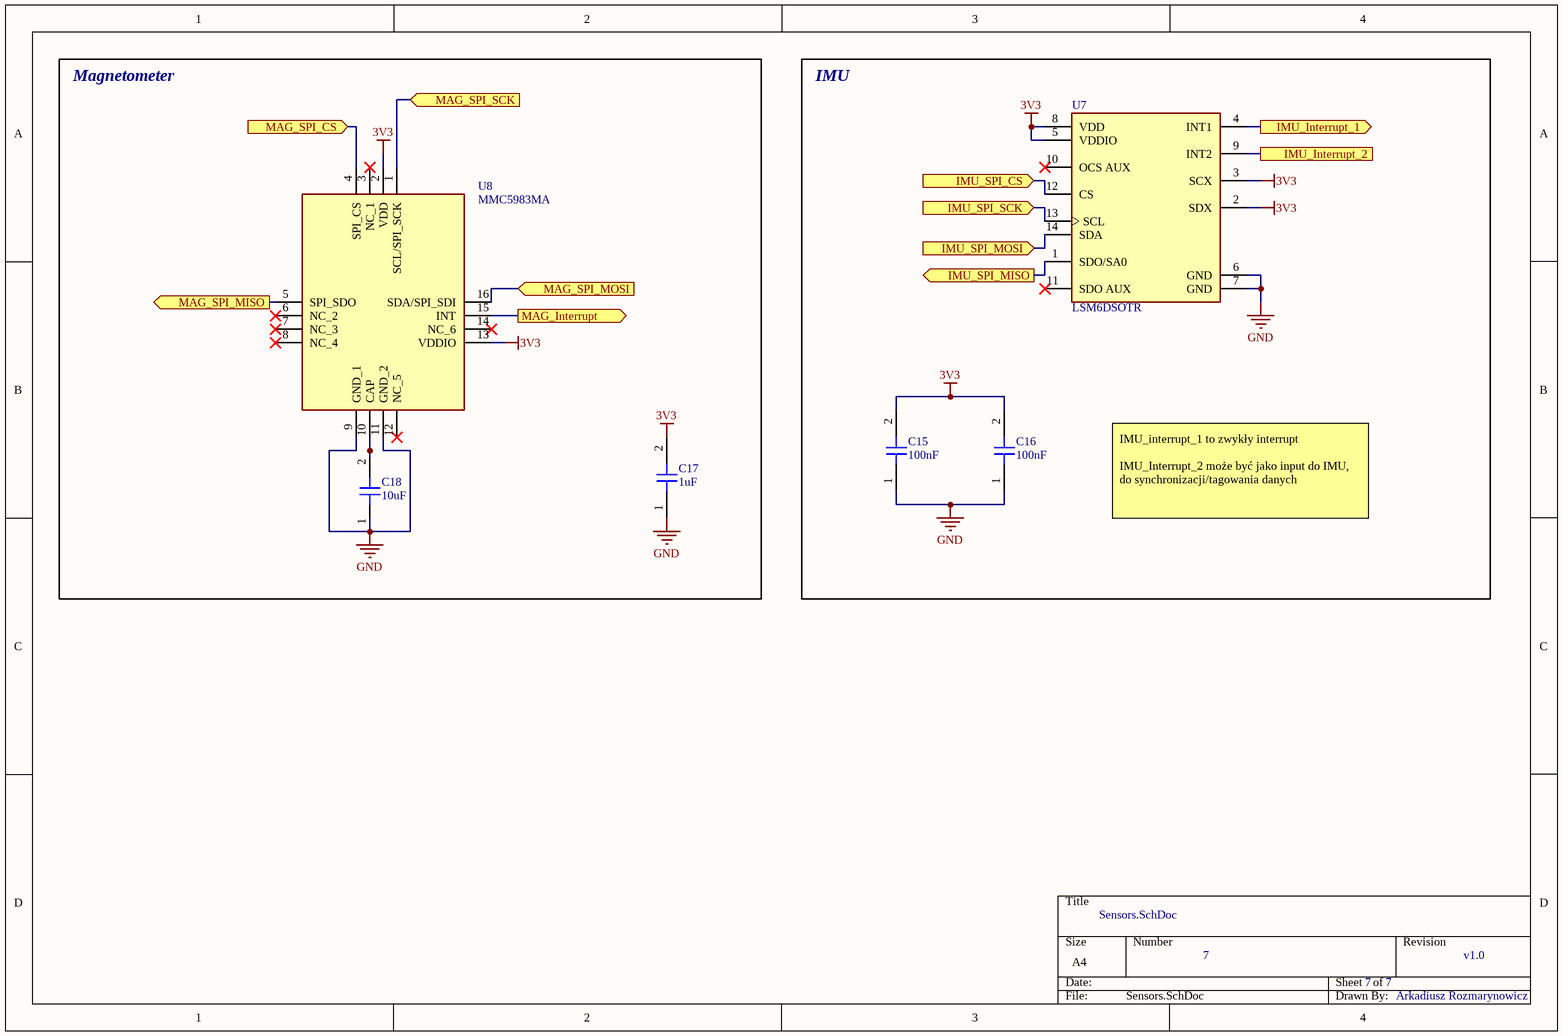
[diagram p4: Sensors.SchDoc]

### Parts
C15  100nF  [Cap_0603_Medium_Density]
C16  100nF  [Cap_0603_Medium_Density]
C17  1uF  [Cap_0603_Medium_Density]
C18  10uF  [Cap_0603_Medium_Density]
U7  LSM6DSOTR  [FP-LGA-14L-DM00249496-MFG]
U8  MMC5983MA  [MMC5983MA]

### Blocks framed on the sheet
Magnetometer: C17 C18 U8
IMU: C15 C16 U7

### Ports
IMU_Interrupt_1 (out), IMU_Interrupt_2, IMU_SPI_CS (in), IMU_SPI_MISO (out), IMU_SPI_MOSI (in), IMU_SPI_SCK (in), MAG_Interrupt (out), MAG_SPI_CS (in), MAG_SPI_MISO (out), MAG_SPI_MOSI (in), MAG_SPI_SCK (in)

### Nets
3V3: C15.2 C16.2 C17.2 U7.2(SDX) U7.3(SCX) U7.5(VDDIO) U7.8(VDD) U8.2(VDD) U8.13(VDDIO)
GND: C15.1 C16.1 C17.1 C18.1 U7.6(GND) U7.7(GND) U8.9(GND_1) U8.11(GND_2)
IMU_CS: U7.12(CS) ; port IMU_SPI_CS
IMU_EXTI1: U7.9(INT2) ; port IMU_Interrupt_2
IMU_EXTI2: U7.4(INT1) ; port IMU_Interrupt_1
IMU_MISO: U7.1(SDO/SA0) ; port IMU_SPI_MISO
IMU_MOSI: U7.14(SDA) ; port IMU_SPI_MOSI
IMU_SCK: U7.13(SCL) ; port IMU_SPI_SCK
MAG_CS: U8.4(SPI_CS) ; port MAG_SPI_CS
MAG_EXTI: U8.15(INT) ; port MAG_Interrupt
MAG_MISO: U8.5(SPI_SDO) ; port MAG_SPI_MISO
MAG_MOSI: U8.16(SDA/SPI_SDI) ; port MAG_SPI_MOSI
MAG_SCK: U8.1(SCL/SPI_SCK) ; port MAG_SPI_SCK
NetC18_2: C18.2 U8.10(CAP)

Not connected (* = marked no-connect by the designer): U7 10(OCS_AUX)* 11(SDO_AUX)*; U8 3(NC_1)* 6(NC_2)* 7(NC_3)* 8(NC_4)* 12(NC_5)* 14(NC_6)*

### Notes on the sheet
- IMU_interrupt_1 to zwykły interrupt
  IMU_Interrupt_2 może być jako input do IMU, do synchronizacji/tagowania danych

### Library data of the parts
C15 C16 = Capacitor_MLLC: Part Number: CC0603KRX7R8BB104; Supplier: Mouser; ComponentLink1Description: Online Store Link; ComponentLink1URL: *; Manufacturer: *; Value: 100nF; Voltage: *; Package: 0603
C17 = Capacitor_MLLC: Part Number: CC0603KRX5R6BB105; Supplier: Mouser; ComponentLink1Description: Online Store Link; ComponentLink1URL: *; Manufacturer: *; Value: 1uF; Voltage: *; Package: 0603
C18 = Capacitor_MLLC: Part Number: C0603C106M7PAC7411; Supplier: Mouser; ComponentLink1Description: Online Store Link; ComponentLink1URL: *; Manufacturer: *; Value: 10uF; Voltage: *; Package: 0603
U7 = CMP-12177-000012-1: CONSUMER MEMS; Manufacturer: STMicroelectronics; Gyro Range: 125/250/500/1000/2000°/s; Max Supply Voltage: 3.6V; Sensor Output: I2C,SPI; Operating Supply Current: 0.55mA; Min Supply Voltage: 1.62V; Sensor Type: Temperature,Accelerometer,Gyroscope; Height: 0.86mm; Device Class L3: Inertial Measurement Units (IMUs); Device Class L1: Sensors; ComponentLink2Description: Datasheet; Device Class L2: Motion Sensors; Temperature: -40°C to +85°C; Package: LGA-14L-DM00249496; Octopart: https://octopart.com/lsm6dsotr-stmicroelectronics-81706672; Temperature Range Low: -40°C; Digikey Description: CONSUMER MEMS; ComponentLink2URL: https://www.st.com/resource/en/datasheet/lsm6dso.pdf; Manufacturer Part Number: LSM6DSOTR; Mouser Description: iNEMO inertial module: "always-on" integrated 3D accelerometer and 3D gyroscope; Footprint Url: https://www.st.com/content/ccc/resource/technical/document/technical_note/73/17/9c/16/dd/96/4a/01/CD00134799.pdf/files/CD00134799.pdf/jcr:content/translations/en.CD00134799.pdf; Lead Free: Yes; RoHS: TRUE; Category: IC; Temperature Range High: +85°C; Manufacturer_Name: STMicroelectronics; Manufacturer_Part_Number: LSM6DSOTR; Part Number: LSM6DSOTR; Supplier: Mouser
U8 = MMC5983MA: 3-AXIS MAGNETIC SENSOR; Manufacturer_Name: MEMSIC; Geometry.Height: 1mm; Manufacturer_Part_Number: MMC5983MA; Mouser Part Number: 438-MMC5983MA; Mouser Price/Stock: https://www.mouser.co.uk/ProductDetail/MEMSIC/MMC5983MA?qs=B6kkDfuK7%2FD5qasHMdEt2g%3D%3D; Datasheet Link: https://www.mouser.com/datasheet/2/821/Memsic_09102019_MMC5983MA_Datasheet_Rev_A-1635338.pdf; Part Number: MMC5983MA; Supplier: Mouser

## Sheet STM32.SchDoc
size A4; DocumentNumber: 5; SheetNumber: 5; SheetTotal: 7
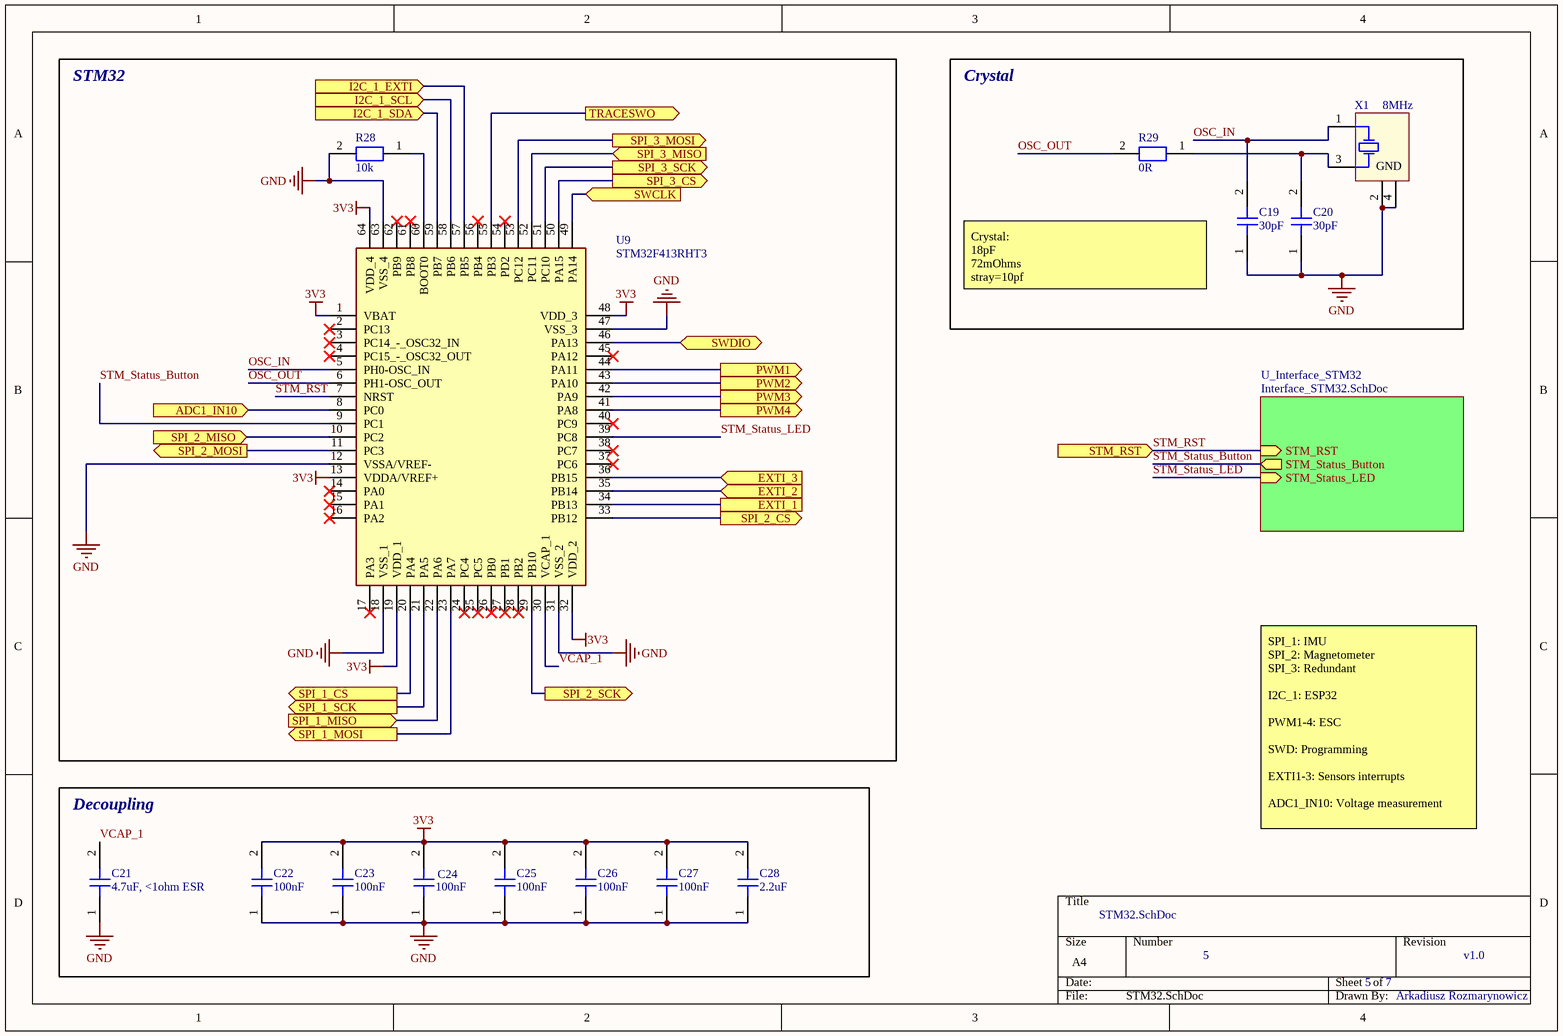
[diagram p5: STM32.SchDoc]

### Parts
C19  30pF  [Cap_0603_Medium_Density]
C20  30pF  [Cap_0603_Medium_Density]
C21  4.7uF, <1ohm ESR  [Cap_0603_Medium_Density]
C22  100nF  [Cap_0603_Medium_Density]
C23  100nF  [Cap_0603_Medium_Density]
C24  100nF  [Cap_0603_Medium_Density]
C25  100nF  [Cap_0603_Medium_Density]
C26  100nF  [Cap_0603_Medium_Density]
C27  100nF  [Cap_0603_Medium_Density]
C28  2.2uF  [Cap_0603_Medium_Density]
R28  10k  [Res_0603_Medium_Density]
R29  0R  [Res_0603_Medium_Density]
U9  STM32F413RHT3  [QFP50P1200X1200X160-64N]
X1  8MHz  [ABRA-ABMM2-4_V]

### Blocks framed on the sheet
STM32: R28 U9
Crystal: C19 C20 R29 X1
Decoupling: C21-C28

### Sub-sheets
U_Interface_STM32 = Interface_STM32.SchDoc: STM_Status_Button (out), STM_Status_LED (in), STM_RST (in)

### Ports
ADC1_IN10 (in), EXTI_1, EXTI_2 (in), EXTI_3 (in), I2C_1_EXTI (in), I2C_1_SCL (in), I2C_1_SDA (in), PWM1 (out), PWM2 (out), PWM3 (out), PWM4 (out), SPI_1_CS (out), SPI_1_MISO (in), SPI_1_MOSI (out), SPI_1_SCK (out), SPI_2_CS (out), SPI_2_MISO (in), SPI_2_MOSI (out), SPI_2_SCK (out), SPI_3_CS (out), SPI_3_MISO (in), SPI_3_MOSI (out), SPI_3_SCK (out), STM_RST (in), SWCLK (in), SWDIO (bidir), TRACESWO (out)

### Nets
3V3: C22.2 C23.2 C24.2 C25.2 C26.2 C27.2 C28.2 U9.1(VBAT) U9.13(VDDA/VREF+) U9.19(VDD_1) U9.32(VDD_2) U9.48(VDD_3) U9.64(VDD_4)
GND: C19.1 C20.1 C21.1 C22.1 C23.1 C24.1 C25.1 C26.1 C27.1 C28.1 R28.2 U9.12(VSSA/VREF-) U9.18(VSS_1) U9.31(VSS_2) U9.47(VSS_3) U9.63(VSS_4) X1.2(GND) X1.4(GND)
Battery_Voltage_Measurement: U9.8(PC0) ; port ADC1_IN10
ESC_P1: U9.44(PA11) ; port PWM1
ESC_P2: U9.43(PA10) ; port PWM2
ESC_P3: U9.42(PA9) ; port PWM3
ESC_P4: U9.41(PA8) ; port PWM4
ESP_I2C_Interrupt: U9.57(PB5) ; port I2C_1_EXTI
ESP_SCL: U9.58(PB6) ; port I2C_1_SCL
ESP_SDA: U9.59(PB7) ; port I2C_1_SDA
IMU_CS: U9.20(PA4) ; port SPI_1_CS
IMU_EXTI1: U9.34(PB13) ; port EXTI_1
IMU_EXTI2: U9.35(PB14) ; port EXTI_2
IMU_MISO: U9.22(PA6) ; port SPI_1_MISO
IMU_MOSI: U9.23(PA7) ; port SPI_1_MOSI
IMU_SCK: U9.21(PA5) ; port SPI_1_SCK
MAG_CS: U9.33(PB12) ; port SPI_2_CS
MAG_EXTI: U9.36(PB15) ; port EXTI_3
MAG_MISO: U9.10(PC2) ; port SPI_2_MISO
MAG_MOSI: U9.11(PC3) ; port SPI_2_MOSI
MAG_SCK: U9.29(PB10) ; port SPI_2_SCK
OSC_IN: C19.2 U9.5(PH0-OSC_IN) X1.1(X1)
OSC_OUT: R29.2 U9.6(PH1-OSC_OUT)
SPI_3_CS: U9.50(PA15) ; port SPI_3_CS
SPI_3_MISO: U9.52(PC11) ; port SPI_3_MISO
SPI_3_MOSI: U9.53(PC12) ; port SPI_3_MOSI
SPI_3_SCK: U9.51(PC10) ; port SPI_3_SCK
STM_RST: U9.7(NRST) ; port STM_RST, sheet U_Interface_STM32/STM_RST
STM_Status_Button: U9.9(PC1) ; sheet U_Interface_STM32/STM_Status_Button
STM_Status_LED: U9.39(PC8) ; sheet U_Interface_STM32/STM_Status_LED
SWCLK: U9.49(PA14) ; port SWCLK
SWDIO: U9.46(PA13) ; port SWDIO
TRACESWO: U9.55(PB3) ; port TRACESWO
VCAP_1: C21.2 U9.30(VCAP_1)
NetC20_2: C20.2 R29.1 X1.3(X2)
NetR28_1: R28.1 U9.60(BOOT0)

Not connected (* = marked no-connect by the designer): U9 2(PC13)* 3(PC14_-_OSC32_IN)* 4(PC15_-_OSC32_OUT)* 14(PA0)* 15(PA1)* 16(PA2)* 17(PA3)* 24(PC4)* 25(PC5)* 26(PB0)* 27(PB1)* 28(PB2)* 37(PC6)* 38(PC7)* 40(PC9)* 45(PA12)* 54(PD2)* 56(PB4)* 61(PB8)* 62(PB9)*

### Notes on the sheet
- (near C19) Crystal:
  18pF
  72mOhms
  stray=10pf
- SPI_1: IMU
  SPI_2: Magnetometer
  SPI_3: Redundant
  I2C_1: ESP32
  PWM1-4: ESC
  SWD: Programming
  EXTI1-3: Sensors interrupts
  ADC1_IN10: Voltage measurement

### Library data of the parts
C19 C20 = Capacitor_MLLC: Part Number: 06031A300FAT2A; Supplier: Mouser; ComponentLink1Description: Online Store Link; ComponentLink1URL: *; Manufacturer: *; Value: 30pF; Voltage: *; Package: 0603
C21 = Capacitor_MLLC: Part Number: 06035U4R7JAT2A; Supplier: Mouser; ComponentLink1Description: Online Store Link; ComponentLink1URL: *; Manufacturer: *; Value: 4.7uF; Voltage: *; Package: 0603
C22-C27 = Capacitor_MLLC: Part Number: CC0603KRX7R8BB104; Supplier: Mouser; ComponentLink1Description: Online Store Link; ComponentLink1URL: *; Manufacturer: *; Value: 100nF; Voltage: *; Package: 0603
C28 = Capacitor_MLLC: Part Number: 06036G225ZAT2A; Supplier: Mouser; ComponentLink1Description: Online Store Link; ComponentLink1URL: *; Manufacturer: *; Value: 2.2uF; Voltage: *; Package: 0603
R28 = Resistor_SMD: Part Number: CR0603AFX-1002EAS; Value: 10k; Manufacturer: *; Supplier: Mouser; Voltage: *; ComponentLink1Description: Online Store Link; ComponentLink1URL: *; Package: 0603
R29 = Resistor_SMD: Part Number: CR0603AJ/-000ELF; Value: 0R; Manufacturer: *; Supplier: Mouser; Voltage: *; ComponentLink1Description: Online Store Link; ComponentLink1URL: *; Package: 0603
U9 = STM32F413RHT3: Arm-Cortex-M4 32b MCU+FPU, 125 DMIPS, up to 1.5MB flash, 320KB RAM, USB OTG FS, 1 ADC, 2 DACs, 2 DFSDMs; Manufacturer_Name: STMicroelectronics; Geometry.Height: 1.6mm; Manufacturer_Part_Number: STM32F413RHT3; Mouser Part Number: 511-STM32F413RHT3; Mouser Price/Stock: https://www.mouser.co.uk/ProductDetail/STMicroelectronics/STM32F413RHT3?qs=FNcb6ahWXRwlxxHMGg5GHA%3D%3D; Datasheet Link: https://www.st.com/resource/en/datasheet/stm32f413cg.pdf; Part Number: STM32F413RHT3; Supplier: Mouser
X1 = CMP-0277-00003-1: Ceramic Surface Mount Low Profile Quartz Crystal, 8 MHz, -20 to 70 degC, 4-Pin 6 x 3.6 x 1.2 mm SMD, RoHS, 1000pcs / Reel; Manufacturer: Abracon; PartNumber: ABMM2-8.000MHZ-E2-T; ESR: 72 Ohm Max.; Shunt Capacitance C0: 7 pF Max.; Load Capacitance CL: 18 pF Typ.; ComponentLink3Description: Package Specification; PackageDescription: 4-Pin SMD, Body 6 x 3.6 mm, Pitch 4.4 mm; ComponentLink1URL: http://www.abracon.com/; Frequency: 8 MHz; ComponentLink2URL: http://www.abracon.com/Resonators/ABMM2.pdf; Temperature Range: -20 to 70 degC; Mounting Technology: Surface Mount; RoHS: TRUE; ComponentLink2Description: Datasheet; ComponentLink3URL: http://www.abracon.com/Resonators/ABMM2.pdf; ComponentLink1Description: Manufacturer URL; Packing: 1000pcs / Reel; Manufacturer_Name: Abracon; Part Number: ABMM2-8.000MHZ-E2-T; Supplier: Mouser

## Sheet Interface_STM32.SchDoc
size A4; DocumentNumber: 7; SheetNumber: 6; SheetTotal: 7
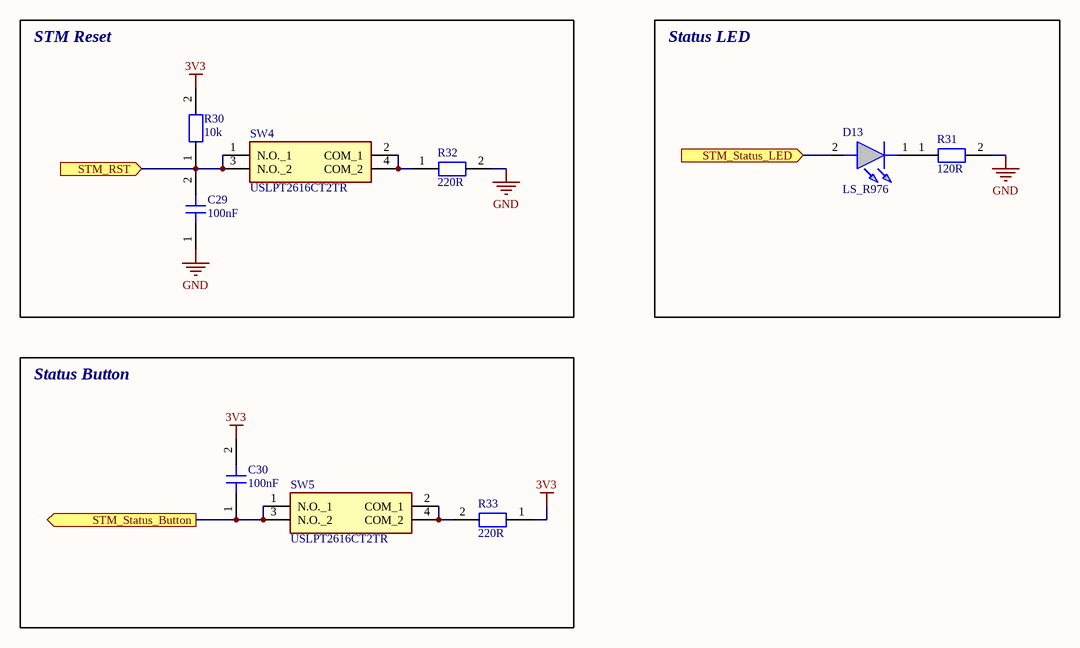
[diagram p6: Interface_STM32.SchDoc]

### Parts
C29  100nF  [Cap_0603_Medium_Density]
C30  100nF  [Cap_0603_Medium_Density]
D13  LS_R976  [LEDC2012X40N]
R30  10k  [Res_0603_Medium_Density]
R31  120R  [Res_0603_Medium_Density]
R32  220R  [Res_0603_Medium_Density]
R33  220R  [Res_0603_Medium_Density]
SW4  USLPT2616CT2TR  [USLPT2616CT2TR]
SW5  USLPT2616CT2TR  [USLPT2616CT2TR]

### Blocks framed on the sheet
STM Reset: C29 R30 R32 SW4
Status LED: D13 R31
Status Button: C30 R33 SW5

### Ports
STM_RST (in), STM_Status_Button (out), STM_Status_LED (in)

### Nets
3V3: C30.2 R30.2 R33.1
GND: C29.1 R31.2 R32.2
STM_RST: C29.2 R30.1 SW4.1(N.O._1) SW4.3(N.O._2) ; port STM_RST
STM_Status_Button: C30.1 SW5.1(N.O._1) SW5.3(N.O._2) ; port STM_Status_Button
STM_Status_LED: D13.2(A) ; port STM_Status_LED
NetD13_1: D13.1(K) R31.1
NetR32_1: R32.1 SW4.2(COM_1) SW4.4(COM_2)
NetR33_2: R33.2 SW5.2(COM_1) SW5.4(COM_2)

### Library data of the parts
C29 C30 = Capacitor_MLLC: Part Number: CC0603KRX7R8BB104; Supplier: Mouser; ComponentLink1Description: Online Store Link; ComponentLink1URL: *; Manufacturer: *; Value: 100nF; Voltage: *; Package: 0603
D13 = LS_R976: as D1 on sheet Power; Mouser Part Number: 720-LSR976D5178; Mouser Price/Stock: https://www.mouser.co.uk/ProductDetail/OSRAM-Opto-Semiconductors/LS-R976?qs=OIr7YF%252B2cWVTfzKl425Fkw%3D%3D; Datasheet Link: http://uk.rs-online.com/web/p/products/4974804; Part Number: LS R976; Supplier: Mouser
R30 = Resistor_SMD: Part Number: CR0603AFX-1002EAS; Value: 10k; Manufacturer: *; Supplier: Mouser; Voltage: *; ComponentLink1Description: Online Store Link; ComponentLink1URL: *; Package: 0603
R31 = Resistor_SMD: Part Number: CR0603-JW-121ELF; Value: 120R; Manufacturer: *; Supplier: Mouser; Voltage: *; ComponentLink1Description: Online Store Link; ComponentLink1URL: *; Package: 0603
R32 R33 = Resistor_SMD: Part Number: CR0603-JW-221ELF; Value: 220R; Manufacturer: *; Supplier: Mouser; Voltage: *; ComponentLink1Description: Online Store Link; ComponentLink1URL: *; Package: 0603
SW4 SW5 = USLPT2616CT2TR: as SW1 on sheet UWB_Positioning; Manufacturer_Part_Number: USLPT2616CT2TR; Mouser Part Number: 506-USLPT2616CT2TR; Mouser Price/Stock: https://www.mouser.co.uk/ProductDetail/TE-Connectivity-Alcoswitch/USLPT2616CT2TR?qs=qSfuJ%252Bfl%2Fd725nA8XgU6qQ%3D%3D; Datasheet Link: https://www.te.com/commerce/DocumentDelivery/DDEController?Action=srchrtrv&DocNm=2337224-1&DocType=Data%20Sheet&DocLang=English&PartCntxt=2337224-1&DocFormat=pdf; Part Number: USLPT2616CT2TR; Supplier: Mouser

## Nets that join several sheets
3V3: main (R10.1 R11.1), Power (8 pins), Connectors (J2.1), UWB_Positioning (13 pins), Sensors (9 pins), STM32 (13 pins), Interface_STM32 (C30.2 R30.2 R33.1)
GND: Power (14 pins), Connectors (15 pins), UWB_Positioning (33 pins), Sensors (8 pins), STM32 (18 pins), Interface_STM32 (C29.1 R31.2 R32.2)
VIN_Battery: Power (U4.5 U4.6 U4.7 U4.8), Connectors (D5.2 D7.1 J1.1 J4.2)
VIN_Programer: Power (U3.5 U3.6 U3.7 U3.8), Connectors (D11.2 J3.1 J5.1)
Battery_Voltage_Measurement: Connectors (D10.1 R12.2 R13.1), STM32 (U9.8)
ESC_P1: Connectors (D8.1 P1.3), STM32 (U9.44)
ESC_P2: Connectors (D8.3 P1.4), STM32 (U9.43)
ESC_P3: Connectors (D8.4 P1.5), STM32 (U9.42)
ESC_P4: Connectors (D8.5 P1.6), STM32 (U9.41)
ESP_DTR: Connectors (D9.1 J5.2), UWB_Positioning (Q2.2 R20.1)
ESP_I2C_Interrupt: UWB_Positioning (U5.13), STM32 (U9.57)
ESP_RTS: Connectors (D9.3 J5.3), UWB_Positioning (Q1.2 R23.1)
ESP_RXD0: Connectors (D9.5 J5.4), UWB_Positioning (U5.34)
ESP_SCL: main (R11.2), UWB_Positioning (U5.11), STM32 (U9.58)
ESP_SDA: main (R10.2), UWB_Positioning (U5.10), STM32 (U9.59)
ESP_TXD0: Connectors (D9.4 J5.5), UWB_Positioning (U5.35)
IMU_CS: Sensors (U7.12), STM32 (U9.20)
IMU_EXTI1: Sensors (U7.9), STM32 (U9.34)
IMU_EXTI2: Sensors (U7.4), STM32 (U9.35)
IMU_MISO: Sensors (U7.1), STM32 (U9.22)
IMU_MOSI: Sensors (U7.14), STM32 (U9.23)
IMU_SCK: Sensors (U7.13), STM32 (U9.21)
MAG_CS: Sensors (U8.4), STM32 (U9.33)
MAG_EXTI: Sensors (U8.15), STM32 (U9.36)
MAG_MISO: Sensors (U8.5), STM32 (U9.10)
MAG_MOSI: Sensors (U8.16), STM32 (U9.11)
MAG_SCK: Sensors (U8.1), STM32 (U9.29)
SPI_3_CS: Connectors (D4.1 J2.2), STM32 (U9.50)
SPI_3_MISO: Connectors (D4.5 J2.4), STM32 (U9.52)
SPI_3_MOSI: Connectors (D4.4 J2.5), STM32 (U9.53)
SPI_3_SCK: Connectors (D4.3 J2.3), STM32 (U9.51)
STM_RST: Connectors (D6.1 J3.2), STM32 (U9.7), Interface_STM32 (C29.2 R30.1 SW4.1 SW4.3)
STM_Status_Button: STM32 (U9.9), Interface_STM32 (C30.1 SW5.1 SW5.3)
STM_Status_LED: STM32 (U9.39), Interface_STM32 (D13.2)
SWCLK: Connectors (D6.3 J3.3), STM32 (U9.49)
SWDIO: Connectors (D6.5 J3.4), STM32 (U9.46)
TRACESWO: Connectors (D6.4 J3.5), STM32 (U9.55)